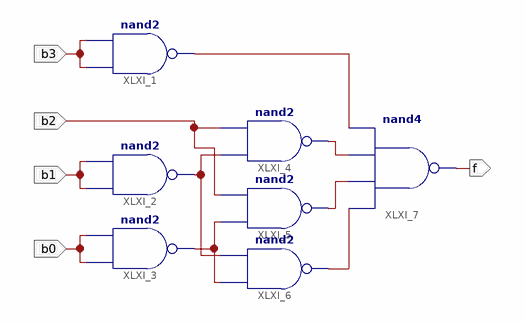
[diagram p0: schematic sheet 1]
// Xilinx ISE schematic f_block.sch (xc9500xl) as structural Verilog: 7 symbols, 5 ports
module f_block (
  input  b2,
  input  b3,
  input  b1,
  input  b0,
  output f
);

  wire XLXN_11, XLXN_12, XLXN_24, XLXN_25, XLXN_29, XLXN_33;

  nand XLXI_1 (XLXN_25, b3, b3);
  nand XLXI_2 (XLXN_11, b1, b1);
  nand XLXI_3 (XLXN_12, b0, b0);
  nand XLXI_4 (XLXN_33, XLXN_11, b2);
  nand XLXI_5 (XLXN_24, XLXN_12, b2);
  nand XLXI_6 (XLXN_29, XLXN_12, XLXN_11);
  nand XLXI_7 (f, XLXN_29, XLXN_24, XLXN_33, XLXN_25);
endmodule
